# Altium schematic sheet thesis.SchDoc: Bachelor Thesis ESC (part 2 of 3)
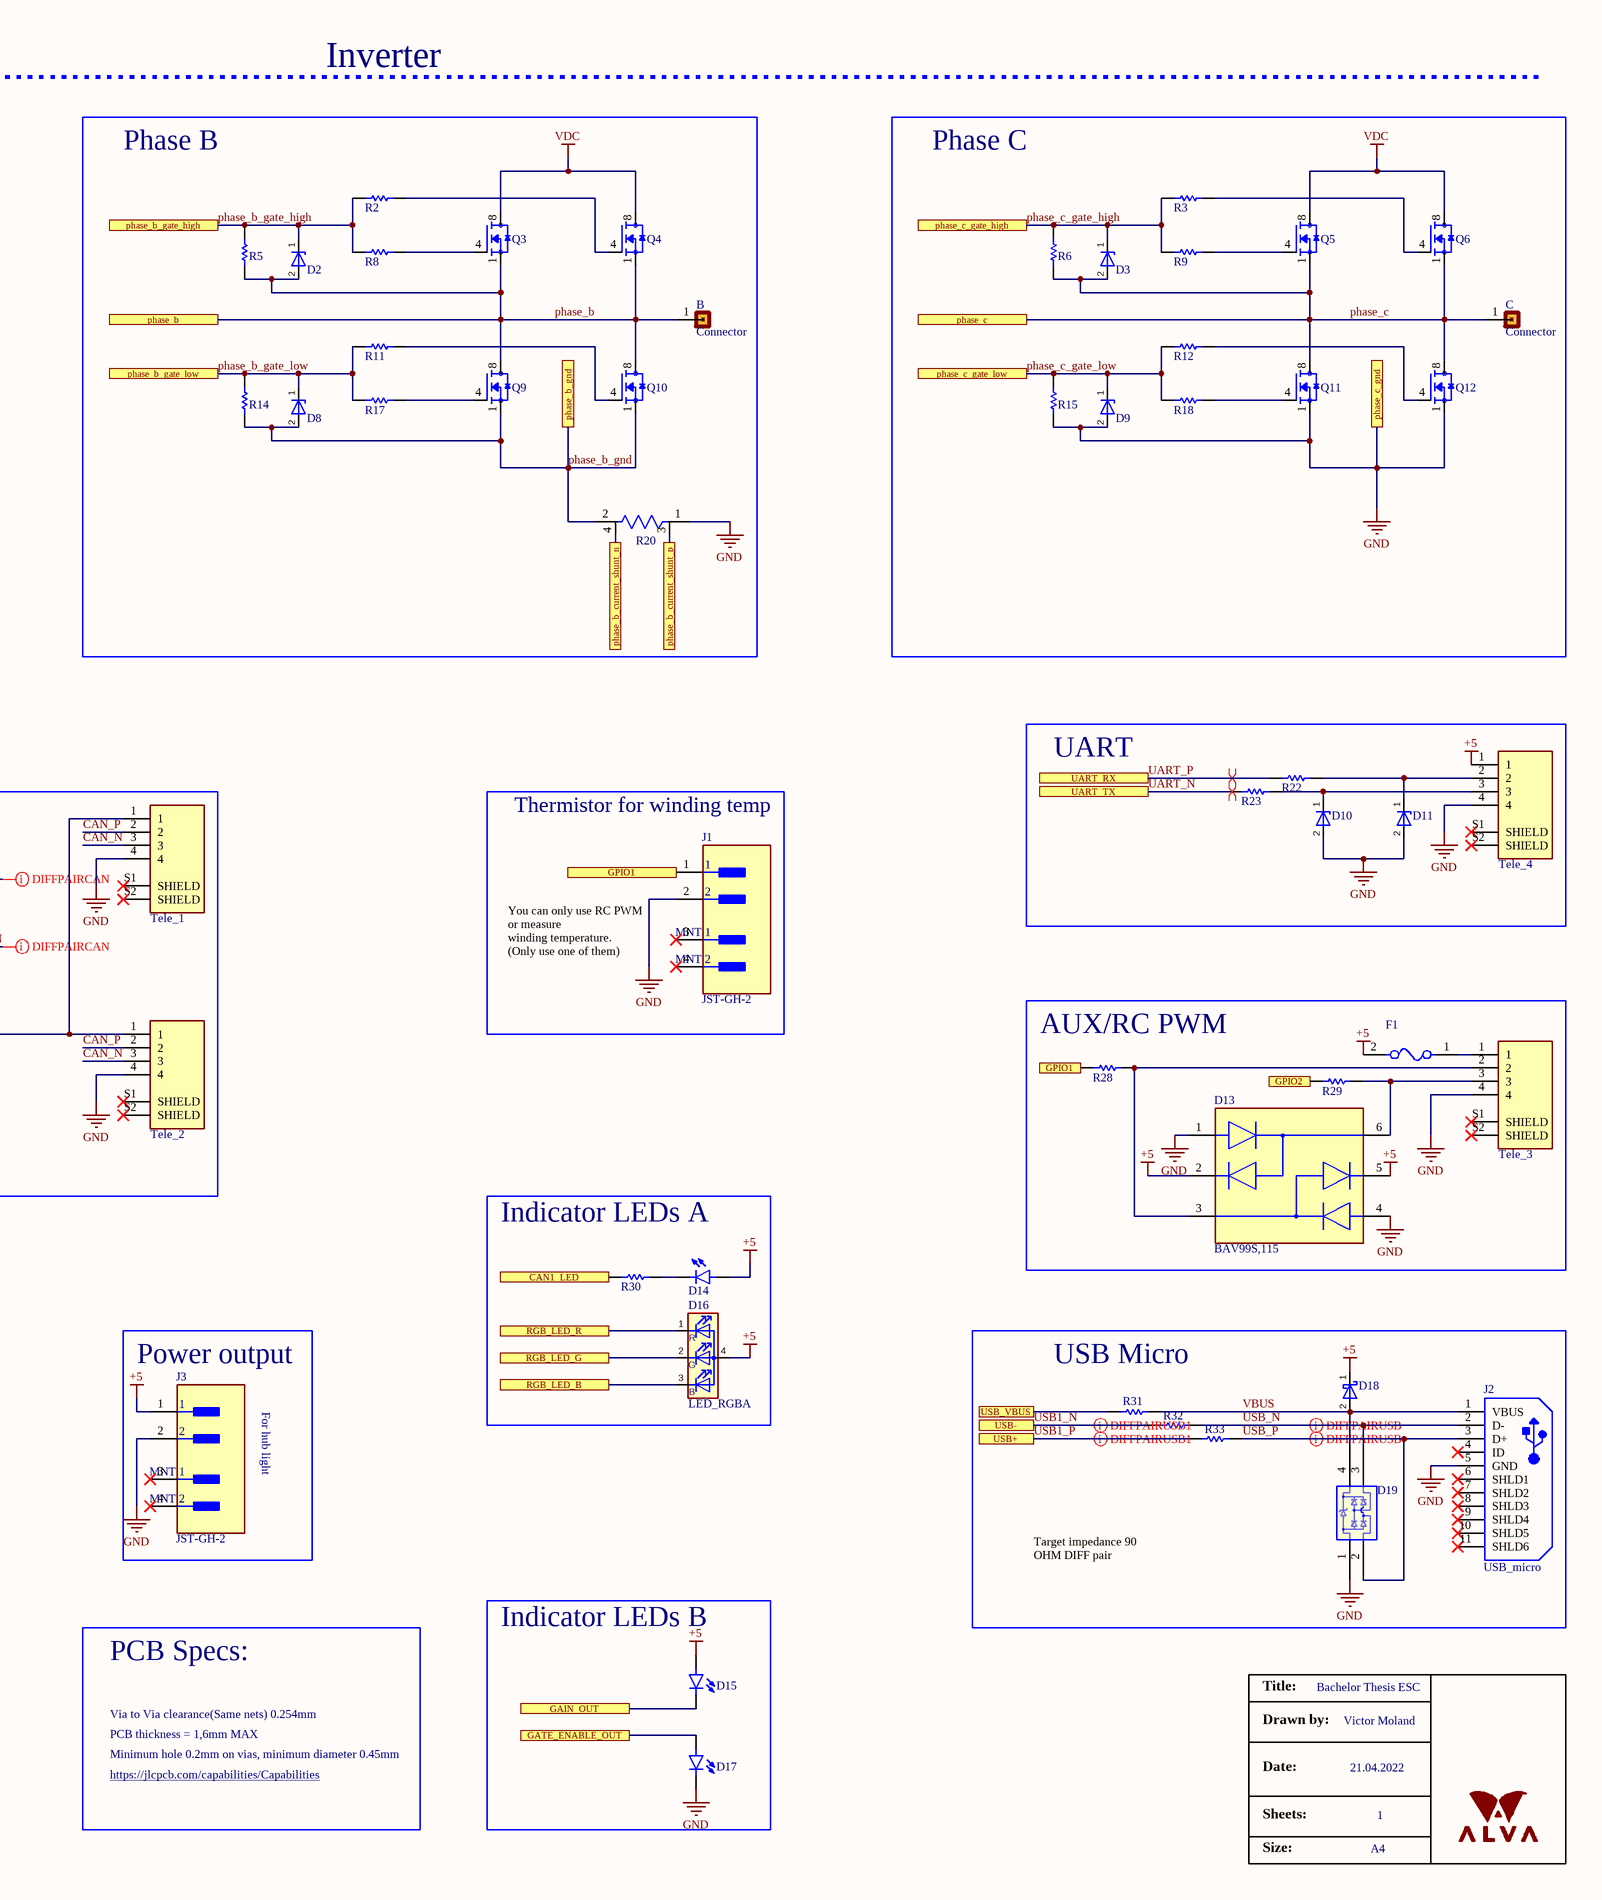
[diagram p2: thesis.SchDoc, right]
## Library data of the parts
* = LOGO: ALVA
A B C J_1 J_5 = Conn_01x01: Connector 01x01
C1 C2 = CAP_Radial: Aluminum Electrolytic Capacitor, Polarized, Aluminum (wet), 63V, 20% +Tol, 20% -Tol, 470uF, Through Hole Mount; Manufacturer: Panasonic; Manufacturer Part Number: ECA1JM471; Dielectric Material: Aluminium; Leakage Current: 296.1uA; Ripple Current: 750mA; Tan Delta: 0.11; Supplier 1: Digi-Key; Supplier Part Number 1: P5196-ND; RoHS: Yes; Category: Aluminum Electrolytic Capacitors; Pricing 1: 1=1,05000, 10=0,79500, 50=0,66020, 100=0,56850, 500=0,44010, 1000=0,37898, 2500=0,35452, 5000=0,33619 (USD); Mount: Through Hole; Number of Pins: 2; Package Shape: Cylindrical; Terminal Finish: Tin; Min Operating Temperature: -40°C; Max Operating Temperature: 85°C; JESD-609 Code: e3; Polarity: Polarized; Capacitance: 470uF; Capacitor Type: Aluminium; Negative Tolerance: 20%; Package Style: RadialMeter; Packaging: Bulk; Positive Tolerance: 20%; Rated DC Voltage (URdc): 63V; Termination: Wire; Diameter: 12.5mm; Length: 20mm; Terminal Pitch: 5mm; REACH SVHC: Yes; RoHS Compliant: Yes; ComponentLink1URL: https://datasheet.ciiva.com:443/pdfs/VipMasterIC/IC/PANA/PANA-S-A0009459698/PANA-S-A0009459698-1.pdf?src-supplier=IHS+Markit; ComponentLink1Description: https://datasheet.ciiva.com:443/pdfs/VipMasterIC/IC/PANA/PANA-S-A0009459698/PANA-S-A0009459698-1.pdf?src-supplier=IHS+Markit; ComponentLink2URL: https://datasheet.ciiva.com/11778/0900766b800274c2-11778050.pdf?src-supplier=RSComponents; ComponentLink2Description: https://datasheet.ciiva.com/11778/0900766b800274c2-11778050.pdf?src-supplier=RSComponents; ComponentLink3URL: https://datasheet.ciiva.com/48520/radial-m-eng-tds-48520521.pdf?src-supplier=Distrelec; ComponentLink3Description: https://datasheet.ciiva.com/48520/radial-m-eng-tds-48520521.pdf?src-supplier=Distrelec; ComponentLink4URL: https://datasheet.ciiva.com/14604/70067785-14604554.pdf?src-supplier=Allied+Electronics; ComponentLink4Description: https://datasheet.ciiva.com/14604/70067785-14604554.pdf?src-supplier=Allied+Electronics; ComponentLink5URL: https://datasheet.ciiva.com/43485/84340-43485354.pdf?src-supplier=Farnell; ComponentLink5Description: https://datasheet.ciiva.com/43485/84340-43485354.pdf?src-supplier=Farnell; ComponentLink6URL: https://datasheet.ciiva.com/46396/84340-46396590.pdf?src-supplier=Element14; ComponentLink6Description: https://datasheet.ciiva.com/46396/84340-46396590.pdf?src-supplier=Element14; ComponentLink7URL: https://datasheet.ciiva.com/11679/aba0000ce12-11679422.pdf?src-supplier=Avnet; ComponentLink7Description: https://datasheet.ciiva.com/11679/aba0000ce12-11679422.pdf?src-supplier=Avnet; ComponentLink8URL: https://datasheet.ciiva.com/16213/aba0000ce12-16213261.pdf?src-supplier=Future+Electronics; ComponentLink8Description: https://datasheet.ciiva.com/16213/aba0000ce12-16213261.pdf?src-supplier=Future+Electronics
C3-C12 = Cap_1210: Ceramic Capacitor, Multilayer, Ceramic, 100V, 10% +Tol, 10% -Tol, X7S, 22% TC, 4.7uF, Surface Mount, 1210; Manufacturer: Murata; Manufacturer Part Number: GCM32DC72A475KE02L; Multilayer: Yes; Reference Standard: AEC-Q200; Supplier 1: Digi-Key; Supplier Part Number 1: 490-14484-1-ND; RoHS: Yes; Category: Ceramic Capacitors; Stock 1: 12146; Pricing 1: 1=1,25000, 10=0,99000, 50=0,85800, 100=0,74250, 500=0,56100 (USD); Mount: Surface Mount; Number of Pins: 2; Dielectric Material: Ceramic; Package Shape: Rectangular; Size Code: 1210; Min Operating Temperature: -55°C; Max Operating Temperature: 125°C; Capacitance: 4.7uF; Capacitor Type: Ceramic; Negative Tolerance: 10%; Packaging: Tape and Reel; Positive Tolerance: 10%; Rated DC Voltage (URdc): 100V; Temperature Characteristics Code: X7S; Termination: Wraparound; REACH SVHC: Yes; RoHS Compliant: Yes; ComponentLink1URL: https://datasheet.ciiva.com:443/pdfs/VipMasterIC/IC/MURE/MURE-S-A0004442191/MURE-S-A0004444772-1.pdf?src-supplier=IHS+Markit; ComponentLink1Description: https://datasheet.ciiva.com:443/pdfs/VipMasterIC/IC/MURE/MURE-S-A0004442191/MURE-S-A0004444772-1.pdf?src-supplier=IHS+Markit; ComponentLink2URL: http://search.murata.co.jp/Ceramy/image/img/A01X/partnumbering_e_02.pdf?src-supplier=Digi-Key; ComponentLink2Description: http://search.murata.co.jp/Ceramy/image/img/A01X/partnumbering_e_02.pdf?src-supplier=Digi-Key
C13 C18 C20 = Cap_0603: Ceramic Capacitor, Multilayer, Ceramic, 25V, 10% +Tol, 10% -Tol, X5R, 15% TC, 0.1uF, Surface Mount, 0603; Manufacturer: Kyocera AVX; Manufacturer Part Number: 06033D104KAT2A; Capacitance: 100nF; Multilayer: Yes; Supplier 1: Digi-Key; RoHS: Yes; Category: Ceramic Capacitors; Stock 1: 1541; Pricing 1: 1=0,34000, 10=0,23100, 50=0,15400, 100=0,13090, 500=0,09240, 1000=0,08085 (USD); Mount: Surface Mount; Number of Pins: 2; Dielectric Material: Ceramic; Package Shape: Rectangular; Size Code: 0603; Terminal Finish: Nickel; Min Operating Temperature: -55°C; Max Operating Temperature: 85°C; JESD-609 Code: e3; Capacitor Type: Ceramic; Negative Tolerance: 10%; Package Style: SMTMeter; Packaging: Tape and Reel; Positive Tolerance: 10%; Rated DC Voltage (URdc): 25V; Temperature Characteristics Code: X5R; Termination: Wraparound; Length: 1.6mm; Width: 0.81mm; Height: 0.9mm; REACH SVHC: Yes; RoHS Compliant: Yes
  C13: Supplier Part Number 1: 478-1244-6-ND; ComponentLink1URL: https://datasheet.ciiva.com:443/pdfs/VipMasterIC/IC/AVXC/AVXC-S-A0009640604/AVXC-S-A0009640604-1.pdf?src-supplier=IHS+Markit; ComponentLink1Description: https://datasheet.ciiva.com:443/pdfs/VipMasterIC/IC/AVXC/AVXC-S-A0009640604/AVXC-S-A0009640604-1.pdf?src-supplier=IHS+Markit; ComponentLink2URL: https://datasheet.ciiva.com/19475/1031061-19475906.pdf?src-supplier=Jameco; ComponentLink2Description: https://datasheet.ciiva.com/19475/1031061-19475906.pdf?src-supplier=Jameco; ComponentLink3URL: https://datasheet.ciiva.com/152/cx5r-152225.pdf?src-supplier=Digi-Key; ComponentLink3Description: https://datasheet.ciiva.com/152/cx5r-152225.pdf?src-supplier=Digi-Key; ComponentLink4URL: https://datasheet.ciiva.com/2987/cx5r-2987761.pdf?src-supplier=Avnet; ComponentLink4Description: https://datasheet.ciiva.com/2987/cx5r-2987761.pdf?src-supplier=Avnet; ComponentLink5URL: https://datasheet.ciiva.com/152/cx5r-152226.pdf?src-supplier=Digi-Key; ComponentLink5Description: https://datasheet.ciiva.com/152/cx5r-152226.pdf?src-supplier=Digi-Key; ComponentLink6URL: https://datasheet.ciiva.com/2987/cx5r-2987762.pdf?src-supplier=Avnet; ComponentLink6Description: https://datasheet.ciiva.com/2987/cx5r-2987762.pdf?src-supplier=Avnet; ComponentLink7URL: https://datasheet.ciiva.com/152/cx5r-152227.pdf?src-supplier=Digi-Key; ComponentLink7Description: https://datasheet.ciiva.com/152/cx5r-152227.pdf?src-supplier=Digi-Key; ComponentLink8URL: https://datasheet.ciiva.com/28613/1666675-28613275.pdf?src-supplier=Element14; ComponentLink8Description: https://datasheet.ciiva.com/28613/1666675-28613275.pdf?src-supplier=Element14; ComponentLink9URL: https://datasheet.ciiva.com/28613/1666675-28613037.pdf?src-supplier=Element14; ComponentLink9Description: https://datasheet.ciiva.com/28613/1666675-28613037.pdf?src-supplier=Element14; ComponentLink10URL: https://datasheet.ciiva.com/16397/cx5r-16397162.pdf?src-supplier=Future+Electronics; ComponentLink10Description: https://datasheet.ciiva.com/16397/cx5r-16397162.pdf?src-supplier=Future+Electronics; ComponentLink11URL: https://datasheet.ciiva.com/28613/759405-28613274.pdf?src-supplier=Element14; ComponentLink11Description: https://datasheet.ciiva.com/28613/759405-28613274.pdf?src-supplier=Element14
  C18: Supplier Part Number 1: 478-1244-1-ND; ComponentLink1URL: https://datasheet.ciiva.com:443/pdfs/VipMasterIC/IC/AVXC/AVXC-S-A0009640604/AVXC-S-A0009640604-1.pdf?src-supplier=IHS+Markit; ComponentLink1Description: https://datasheet.ciiva.com:443/pdfs/VipMasterIC/IC/AVXC/AVXC-S-A0009640604/AVXC-S-A0009640604-1.pdf?src-supplier=IHS+Markit; ComponentLink2URL: https://datasheet.ciiva.com/19475/1031061-19475906.pdf?src-supplier=Jameco; ComponentLink2Description: https://datasheet.ciiva.com/19475/1031061-19475906.pdf?src-supplier=Jameco; ComponentLink3URL: https://datasheet.ciiva.com/152/cx5r-152225.pdf?src-supplier=Digi-Key; ComponentLink3Description: https://datasheet.ciiva.com/152/cx5r-152225.pdf?src-supplier=Digi-Key; ComponentLink4URL: https://datasheet.ciiva.com/2987/cx5r-2987761.pdf?src-supplier=Avnet; ComponentLink4Description: https://datasheet.ciiva.com/2987/cx5r-2987761.pdf?src-supplier=Avnet; ComponentLink5URL: https://datasheet.ciiva.com/152/cx5r-152226.pdf?src-supplier=Digi-Key; ComponentLink5Description: https://datasheet.ciiva.com/152/cx5r-152226.pdf?src-supplier=Digi-Key; ComponentLink6URL: https://datasheet.ciiva.com/2987/cx5r-2987762.pdf?src-supplier=Avnet; ComponentLink6Description: https://datasheet.ciiva.com/2987/cx5r-2987762.pdf?src-supplier=Avnet; ComponentLink7URL: https://datasheet.ciiva.com/152/cx5r-152227.pdf?src-supplier=Digi-Key; ComponentLink7Description: https://datasheet.ciiva.com/152/cx5r-152227.pdf?src-supplier=Digi-Key; ComponentLink8URL: https://datasheet.ciiva.com/28613/1666675-28613275.pdf?src-supplier=Element14; ComponentLink8Description: https://datasheet.ciiva.com/28613/1666675-28613275.pdf?src-supplier=Element14; ComponentLink9URL: https://datasheet.ciiva.com/28613/1666675-28613037.pdf?src-supplier=Element14; ComponentLink9Description: https://datasheet.ciiva.com/28613/1666675-28613037.pdf?src-supplier=Element14; ComponentLink10URL: https://datasheet.ciiva.com/16397/cx5r-16397162.pdf?src-supplier=Future+Electronics; ComponentLink10Description: https://datasheet.ciiva.com/16397/cx5r-16397162.pdf?src-supplier=Future+Electronics; ComponentLink11URL: https://datasheet.ciiva.com/28613/759405-28613274.pdf?src-supplier=Element14; ComponentLink11Description: https://datasheet.ciiva.com/28613/759405-28613274.pdf?src-supplier=Element14
  C20: ComponentLink1URL: https://datasheet.ciiva.com:443/pdfs/VipMasterIC/IC/MURE/MURE-S-A0004370842/MURE-S-A0004372063-1.pdf?src-supplier=IHS+Markit; ComponentLink1Description: https://datasheet.ciiva.com:443/pdfs/VipMasterIC/IC/MURE/MURE-S-A0004370842/MURE-S-A0004372063-1.pdf?src-supplier=IHS+Markit; ComponentLink2URL: http://search.murata.co.jp/Ceramy/image/img/A01X/G101/ENG/GCM155R71E104KE02-01.pdf?src-supplier=Digi-Key; ComponentLink2Description: http://search.murata.co.jp/Ceramy/image/img/A01X/G101/ENG/GCM155R71E104KE02-01.pdf?src-supplier=Digi-Key; Supplier Part Number 1: 478-1244-6-ND; ComponentLink3URL: https://datasheet.ciiva.com:443/pdfs/VipMasterIC/IC/AVXC/AVXC-S-A0009640604/AVXC-S-A0009640604-1.pdf?src-supplier=IHS+Markit; ComponentLink3Description: https://datasheet.ciiva.com:443/pdfs/VipMasterIC/IC/AVXC/AVXC-S-A0009640604/AVXC-S-A0009640604-1.pdf?src-supplier=IHS+Markit; ComponentLink4URL: https://datasheet.ciiva.com/19475/1031061-19475906.pdf?src-supplier=Jameco; ComponentLink4Description: https://datasheet.ciiva.com/19475/1031061-19475906.pdf?src-supplier=Jameco; ComponentLink5URL: https://datasheet.ciiva.com/152/cx5r-152225.pdf?src-supplier=Digi-Key; ComponentLink5Description: https://datasheet.ciiva.com/152/cx5r-152225.pdf?src-supplier=Digi-Key; ComponentLink6URL: https://datasheet.ciiva.com/2987/cx5r-2987761.pdf?src-supplier=Avnet; ComponentLink6Description: https://datasheet.ciiva.com/2987/cx5r-2987761.pdf?src-supplier=Avnet; ComponentLink7URL: https://datasheet.ciiva.com/152/cx5r-152226.pdf?src-supplier=Digi-Key; ComponentLink7Description: https://datasheet.ciiva.com/152/cx5r-152226.pdf?src-supplier=Digi-Key; ComponentLink8URL: https://datasheet.ciiva.com/2987/cx5r-2987762.pdf?src-supplier=Avnet; ComponentLink8Description: https://datasheet.ciiva.com/2987/cx5r-2987762.pdf?src-supplier=Avnet; ComponentLink9URL: https://datasheet.ciiva.com/152/cx5r-152227.pdf?src-supplier=Digi-Key; ComponentLink9Description: https://datasheet.ciiva.com/152/cx5r-152227.pdf?src-supplier=Digi-Key; ComponentLink10URL: https://datasheet.ciiva.com/28613/1666675-28613275.pdf?src-supplier=Element14; ComponentLink10Description: https://datasheet.ciiva.com/28613/1666675-28613275.pdf?src-supplier=Element14; ComponentLink11URL: https://datasheet.ciiva.com/28613/1666675-28613037.pdf?src-supplier=Element14; ComponentLink11Description: https://datasheet.ciiva.com/28613/1666675-28613037.pdf?src-supplier=Element14; ComponentLink12URL: https://datasheet.ciiva.com/16397/cx5r-16397162.pdf?src-supplier=Future+Electronics; ComponentLink12Description: https://datasheet.ciiva.com/16397/cx5r-16397162.pdf?src-supplier=Future+Electronics; ComponentLink13URL: https://datasheet.ciiva.com/28613/759405-28613274.pdf?src-supplier=Element14; ComponentLink13Description: https://datasheet.ciiva.com/28613/759405-28613274.pdf?src-supplier=Element14
C14 = Cap_0603: Ceramic Capacitor, Multilayer, Ceramic, 16V, 10% +Tol, 10% -Tol, X5R, 15% TC, 1uF, Surface Mount, 0603; Manufacturer: Kyocera AVX; Manufacturer Part Number: 0603YD105KAT2A; Multilayer: Yes; Supplier 1: Digi-Key; Supplier Part Number 1: 478-1249-1-ND; RoHS: Yes; Category: Ceramic Capacitors; Stock 1: 1775727; Pricing 1: 1=0,13000, 10=0,09000, 50=0,05080, 100=0,04210, 500=0,02952, 1000=0,02444 (USD); Mount: Surface Mount; Number of Pins: 2; Dielectric Material: Ceramic; Package Shape: Rectangular; Size Code: 0603; Terminal Finish: Nickel; Min Operating Temperature: -55°C; Max Operating Temperature: 85°C; Capacitance: 1uF; Capacitor Type: Ceramic; Negative Tolerance: 10%; Package Style: SMTMeter; Packaging: Tape and Reel; Positive Tolerance: 10%; Rated DC Voltage (URdc): 16V; Temperature Characteristics Code: X5R; Termination: Wraparound; JESD-609 Code: e3; Length: 1.6mm; Width: 0.81mm; Height: 0.9mm; REACH SVHC: Yes; RoHS Compliant: Yes; ComponentLink1URL: https://datasheet.ciiva.com:443/pdfs/VipMasterIC/IC/AVXC/AVXC-S-A0009640604/AVXC-S-A0009640604-1.pdf?src-supplier=IHS+Markit; ComponentLink1Description: https://datasheet.ciiva.com:443/pdfs/VipMasterIC/IC/AVXC/AVXC-S-A0009640604/AVXC-S-A0009640604-1.pdf?src-supplier=IHS+Markit; ComponentLink2URL: https://datasheet.ciiva.com/11788/0900766b80def1a5-11788563.pdf?src-supplier=RSComponents; ComponentLink2Description: https://datasheet.ciiva.com/11788/0900766b80def1a5-11788563.pdf?src-supplier=RSComponents; ComponentLink3URL: https://datasheet.ciiva.com/34303/2012654-34303835.pdf?src-supplier=Jameco; ComponentLink3Description: https://datasheet.ciiva.com/34303/2012654-34303835.pdf?src-supplier=Jameco; ComponentLink4URL: https://datasheet.ciiva.com/2987/cx5r-2987890.pdf?src-supplier=Avnet; ComponentLink4Description: https://datasheet.ciiva.com/2987/cx5r-2987890.pdf?src-supplier=Avnet; ComponentLink5URL: https://datasheet.ciiva.com/5412/cx5r-5412550.pdf?src-supplier=Mouser; ComponentLink5Description: https://datasheet.ciiva.com/5412/cx5r-5412550.pdf?src-supplier=Mouser; ComponentLink6URL: https://datasheet.ciiva.com/150/cx5r-150392.pdf?src-supplier=Digi-Key; ComponentLink6Description: https://datasheet.ciiva.com/150/cx5r-150392.pdf?src-supplier=Digi-Key; ComponentLink7URL: https://datasheet.ciiva.com/14590/70001028-14590632.pdf?src-supplier=Allied+Electronics; ComponentLink7Description: https://datasheet.ciiva.com/14590/70001028-14590632.pdf?src-supplier=Allied+Electronics; ComponentLink8URL: https://datasheet.ciiva.com/14586/70001028-14586715.pdf?src-supplier=Allied+Electronics; ComponentLink8Description: https://datasheet.ciiva.com/14586/70001028-14586715.pdf?src-supplier=Allied+Electronics; ComponentLink9URL: https://datasheet.ciiva.com/150/cx5r-150393.pdf?src-supplier=Digi-Key; ComponentLink9Description: https://datasheet.ciiva.com/150/cx5r-150393.pdf?src-supplier=Digi-Key; ComponentLink10URL: https://datasheet.ciiva.com/1458/84508-1458137.pdf?src-supplier=Element14; ComponentLink10Description: https://datasheet.ciiva.com/1458/84508-1458137.pdf?src-supplier=Element14; ComponentLink11URL: https://datasheet.ciiva.com/150/cx5r-150394.pdf?src-supplier=Digi-Key; ComponentLink11Description: https://datasheet.ciiva.com/150/cx5r-150394.pdf?src-supplier=Digi-Key; ComponentLink12URL: https://datasheet.ciiva.com/1458/84508-1458138.pdf?src-supplier=Element14; ComponentLink12Description: https://datasheet.ciiva.com/1458/84508-1458138.pdf?src-supplier=Element14
C15-C17 = Cap_0603: Ceramic Capacitor, Multilayer, Ceramic, 16V, 10% +Tol, 10% -Tol, X6S, 22% TC, 4.7uF, Surface Mount, 0603; Manufacturer: Murata; Manufacturer Part Number: GRT188C81C475KE13D; Multilayer: Yes; Reference Standard: AEC-Q200; Supplier 1: Digi-Key; Supplier Part Number 1: 490-12289-1-ND; RoHS: Yes; Category: Ceramic Capacitors; Stock 1: 305710; Pricing 1: 1=0,31000, 10=0,21000, 50=0,14000, 100=0,11890, 500=0,08396, 1000=0,07346 (USD); Mount: Surface Mount; Number of Pins: 2; Dielectric Material: Ceramic; Package Shape: Rectangular; Size Code: 0603; Terminal Finish: Nickel; Min Operating Temperature: -55°C; Max Operating Temperature: 105°C; JESD-609 Code: e3; Capacitance: 4.7uF; Capacitor Type: Ceramic; Negative Tolerance: 10%; Packaging: Tape and Reel; Positive Tolerance: 10%; Rated DC Voltage (URdc): 16V; Temperature Characteristics Code: X6S; Termination: Wraparound; REACH SVHC: Yes; RoHS Compliant: Yes; ComponentLink1URL: https://datasheet.ciiva.com:443/pdfs/VipMasterIC/IC/MURE/MURE-S-A0004410517/MURE-S-A0004413550-1.pdf?src-supplier=IHS+Markit; ComponentLink1Description: https://datasheet.ciiva.com:443/pdfs/VipMasterIC/IC/MURE/MURE-S-A0004410517/MURE-S-A0004413550-1.pdf?src-supplier=IHS+Markit; ComponentLink2URL: http://search.murata.co.jp/Ceramy/image/img/A01X/G101/ENG/GRT188C81C475KE13-01.pdf?src-supplier=Digi-Key; ComponentLink2Description: http://search.murata.co.jp/Ceramy/image/img/A01X/G101/ENG/GRT188C81C475KE13-01.pdf?src-supplier=Digi-Key
C19 = Cap_0603: Ceramic Capacitor, Multilayer, Ceramic, 50V, 10% +Tol, 10% -Tol, X7R, 15% TC, 0.00068uF, Surface Mount, 0603; Manufacturer: Kyocera AVX; Manufacturer Part Number: 06035C681KAT2A; Capacitance: 680pF; Multilayer: Yes; Supplier 1: Newark; Supplier Part Number 1: 95W9221; RoHS: Yes; Category: Ceramic Capacitors; Stock 1: 68350; Pricing 1: 10=0,14300, 25=0,12000, 50=0,09600, 100=0,07300, 250=0,06200, 500=0,05000, 1000=0,04500 (USD); Mount: Surface Mount; Number of Pins: 2; Dielectric Material: Ceramic; Size Code: 0603; Terminal Finish: Nickel; Package Shape: Rectangular; Min Operating Temperature: -55°C; Max Operating Temperature: 125°C; JESD-609 Code: e3; Capacitor Type: Ceramic; Negative Tolerance: 10%; Package Style: SMTMeter; Packaging: Tape and Reel; Positive Tolerance: 10%; Rated DC Voltage (URdc): 50V; Temperature Characteristics Code: X7R; Termination: Wraparound; Length: 1.6mm; Width: 0.81mm; Height: 0.9mm; REACH SVHC: Yes; RoHS Compliant: Yes; ComponentLink1URL: https://datasheet.ciiva.com:443/pdfs/VipMasterIC/IC/AVXC/AVXC-S-A0009640452/AVXC-S-A0009640452-1.pdf?src-supplier=IHS+Markit; ComponentLink1Description: https://datasheet.ciiva.com:443/pdfs/VipMasterIC/IC/AVXC/AVXC-S-A0009640452/AVXC-S-A0009640452-1.pdf?src-supplier=IHS+Markit; ComponentLink2URL: https://datasheet.ciiva.com/15212/getdatasheetpartid-131075-15212330.pdf?src-supplier=Verical; ComponentLink2Description: https://datasheet.ciiva.com/15212/getdatasheetpartid-131075-15212330.pdf?src-supplier=Verical; ComponentLink3URL: https://datasheet.ciiva.com/151/cx7r-151060.pdf?src-supplier=Digi-Key; ComponentLink3Description: https://datasheet.ciiva.com/151/cx7r-151060.pdf?src-supplier=Digi-Key; ComponentLink4URL: https://datasheet.ciiva.com/151/cx7r-151061.pdf?src-supplier=Digi-Key; ComponentLink4Description: https://datasheet.ciiva.com/151/cx7r-151061.pdf?src-supplier=Digi-Key; ComponentLink5URL: https://datasheet.ciiva.com/151/cx7r-151062.pdf?src-supplier=Digi-Key; ComponentLink5Description: https://datasheet.ciiva.com/151/cx7r-151062.pdf?src-supplier=Digi-Key; ComponentLink6URL: https://datasheet.ciiva.com/11522/cx7r-11522102.pdf?src-supplier=Avnet; ComponentLink6Description: https://datasheet.ciiva.com/11522/cx7r-11522102.pdf?src-supplier=Avnet; ComponentLink7URL: https://datasheet.ciiva.com/22676/1679506-22676967.pdf?src-supplier=Element14; ComponentLink7Description: https://datasheet.ciiva.com/22676/1679506-22676967.pdf?src-supplier=Element14; ComponentLink8URL: https://datasheet.ciiva.com/28533/1679506-28533415.pdf?src-supplier=Element14; ComponentLink8Description: https://datasheet.ciiva.com/28533/1679506-28533415.pdf?src-supplier=Element14; ComponentLink9URL: https://datasheet.ciiva.com/5415/cx7r-5415849.pdf?src-supplier=Mouser; ComponentLink9Description: https://datasheet.ciiva.com/5415/cx7r-5415849.pdf?src-supplier=Mouser; ComponentLink10URL: https://datasheet.ciiva.com/11499/cx7r-11499705.pdf?src-supplier=Avnet; ComponentLink10Description: https://datasheet.ciiva.com/11499/cx7r-11499705.pdf?src-supplier=Avnet
C21 = Cap_1210: Ceramic Capacitor, Multilayer, Ceramic, 10V, 20% +Tol, 20% -Tol, X7R, 15% TC, 47uF, Surface Mount, 1210; Manufacturer: Murata; Manufacturer Part Number: GRM32ER71A476ME15L; Multilayer: Yes; Supplier 1: Digi-Key; Supplier Part Number 1: 490-6543-1-ND; RoHS: Yes; Category: Ceramic Capacitors; Stock 1: 52676; Pricing 1: 1=0,96000, 10=0,72900, 50=0,60600, 100=0,52180, 500=0,40394 (USD); Mount: Surface Mount; Number of Pins: 2; Dielectric Material: Ceramic; Package Shape: Rectangular; Size Code: 1210; Terminal Finish: Nickel; Min Operating Temperature: -55°C; Max Operating Temperature: 125°C; JESD-609 Code: e3; Capacitance: 47uF; Capacitor Type: Ceramic; Negative Tolerance: 20%; Package Style: SMTMeter; Packaging: Tape and Reel; Positive Tolerance: 20%; Rated DC Voltage (URdc): 10V; Temperature Characteristics Code: X7R; Termination: Wraparound; Length: 3.2mm; Width: 2.5mm; Height: 2.5mm; REACH SVHC: Yes; RoHS Compliant: Yes; ComponentLink1URL: https://datasheet.ciiva.com:443/pdfs/VipMasterIC/IC/MURE/MURE-S-A0000034126/MURE-S-A0000034126-1.pdf?src-supplier=IHS+Markit; ComponentLink1Description: https://datasheet.ciiva.com:443/pdfs/VipMasterIC/IC/MURE/MURE-S-A0000034126/MURE-S-A0000034126-1.pdf?src-supplier=IHS+Markit; ComponentLink2URL: https://datasheet.ciiva.com/46441/1754712-46441338.pdf?src-supplier=Element14; ComponentLink2Description: https://datasheet.ciiva.com/46441/1754712-46441338.pdf?src-supplier=Element14; ComponentLink3URL: https://datasheet.ciiva.com/6264/partnumbering-e-01-6264587.pdf?src-supplier=Digi-Key; ComponentLink3Description: https://datasheet.ciiva.com/6264/partnumbering-e-01-6264587.pdf?src-supplier=Digi-Key; ComponentLink4URL: https://datasheet.ciiva.com/6264/partnumbering-e-01-6264586.pdf?src-supplier=Digi-Key; ComponentLink4Description: https://datasheet.ciiva.com/6264/partnumbering-e-01-6264586.pdf?src-supplier=Digi-Key; ComponentLink5URL: https://datasheet.ciiva.com/6264/partnumbering-e-01-6264588.pdf?src-supplier=Digi-Key; ComponentLink5Description: https://datasheet.ciiva.com/6264/partnumbering-e-01-6264588.pdf?src-supplier=Digi-Key; ComponentLink6URL: https://datasheet.ciiva.com/11606/product-11606523.pdf?src-supplier=Avnet; ComponentLink6Description: https://datasheet.ciiva.com/11606/product-11606523.pdf?src-supplier=Avnet; ComponentLink7URL: https://datasheet.ciiva.com/16497/product-16497006.pdf?src-supplier=Future+Electronics; ComponentLink7Description: https://datasheet.ciiva.com/16497/product-16497006.pdf?src-supplier=Future+Electronics
D1-D3 D7-D9 = Zener_16V: Manufacturer: Taiwan Semiconductor; Supplier 1: Digi-Key; Manufacturer Part Number: BZD27C16PWH; RoHS: No; Category: Zener Diodes; Stock 1: 1746; Pricing 1: 1=0,52000, 10=0,44700, 100=0,33350, 500=0,26202, 1000=0,20247 (USD); Supplier Part Number 1: BZD27C16PWHCT-ND
D4-D6 = Zener_51V: Trans Voltage Suppressor Diode, 5000W, 51V V(RWM), Unidirectional, 1 Element, Silicon, DO-214AB; Manufacturer: Vishay; Package Body Material: Plastic; Additional Feature: EXCELLENT CLAMPING CAPABILITY; Max Breakdown Voltage: 62.7V; Min Breakdown Voltage: 56.7V; Non-rep Peak Rev Power Dis-Max: 5kW; Number of Elements: 1; Time @ Peak Reflow Temperature-Max (s): 30s; Reference Standard: IEC-61000-4-2; Supplier 1: Digi-Key; Supplier Part Number 1: SMC5K51A-M3/IGICT-ND; Manufacturer Part Number: SMC5K51A-M3/I; RoHS: Yes; Category: TVS Diodes; Stock 1: 764; Pricing 1: 1=0,94000, 10=0,84400, 100=0,65780, 500=0,54340, 1000=0,42900 (USD); Number of Pins: 2; Diode Element Material: SILICON; Package Shape: Rectangular; Terminal Finish: Tin; Min Operating Temperature: -55°C; Max Operating Temperature: 150°C; JESD-609 Code: e3; Polarity: Unidirectional; Diode Type: TRANS VOLTAGE SUPPRESSOR; JESD-30 Code: R-PDSO-C2; Moisture Sensitivity Level: 1; Package Style: SMALL OUTLINEMeter; Peak Reflow Temperature (Cel): 260°C; Rep Pk Reverse Voltage-Max: 51V; Surface Mount: Yes; Technology: AVALANCHE; Terminal Form: C BEND; Terminal Position: DUAL; JEDEC-95 Code: DO-214AB; REACH SVHC: No SVHC; RoHS Compliant: Yes; ComponentLink1URL: https://datasheet.ciiva.com:443/pdfs/VipMasterIC/IC/VISH/VISH-S-A0007266867/VISH-S-A0007266867-1.pdf?src-supplier=IHS+Markit; ComponentLink1Description: https://datasheet.ciiva.com:443/pdfs/VipMasterIC/IC/VISH/VISH-S-A0007266867/VISH-S-A0007266867-1.pdf?src-supplier=IHS+Markit; ComponentLink2URL: http://www.vishay.com/docs/87742/smc5k10a.pdf?src-supplier=Digi-Key; ComponentLink2Description: http://www.vishay.com/docs/87742/smc5k10a.pdf?src-supplier=Digi-Key
D10 D11 = Zener_5V: Trans Voltage Suppressor Diode, 200W, 5V V(RWM), Unidirectional, 1 Element, Silicon; Manufacturer: MCC; Package Body Material: Plastic; Max Breakdown Voltage: 7V; Min Breakdown Voltage: 6.4V; Breakdown Voltage-Nom: 6.7V; Clamping Voltage-Max: 9.2V; Number of Elements: 1; Time @ Peak Reflow Temperature-Max (s): 10s; Qualification Status: Not Qualified; Supplier 1: Digi-Key; Manufacturer Part Number: SMF5.0A-TP; RoHS: Yes; Category: TVS Diodes; Stock 1: 83846; Pricing 1: 1=0,45000, 10=0,33600, 100=0,20900, 500=0,14300, 1000=0,11000 (USD); Number of Pins: 2; Diode Element Material: SILICON; Package Shape: Rectangular; Terminal Finish: Tin; JESD-609 Code: e3; Polarity: Unidirectional; Diode Type: TRANS VOLTAGE SUPPRESSOR; JESD-30 Code: R-PDSO-F2; Moisture Sensitivity Level: 1; Non-rep Peak Rev Power Dis-Max: 200W; Package Style: SMALL OUTLINEMeter; Peak Reflow Temperature (Cel): 260°C; Rep Pk Reverse Voltage-Max: 5V; Surface Mount: Yes; Technology: AVALANCHE; Terminal Form: Flat; Terminal Position: DUAL; REACH SVHC: No SVHC; RoHS Compliant: Yes; ComponentLink1URL: https://datasheet.ciiva.com:443/pdfs/VipMasterIC/IC/MCCC/MCCC-S-A0009835486/MCCC-S-A0009835486-1.pdf?src-supplier=IHS+Markit; ComponentLink1Description: https://datasheet.ciiva.com:443/pdfs/VipMasterIC/IC/MCCC/MCCC-S-A0009835486/MCCC-S-A0009835486-1.pdf?src-supplier=IHS+Markit; ComponentLink2URL: https://datasheet.ciiva.com/333/smf5-0170sod-123fl-333395.pdf?src-supplier=Digi-Key; ComponentLink2Description: https://datasheet.ciiva.com/333/smf5-0170sod-123fl-333395.pdf?src-supplier=Digi-Key; ComponentLink3URL: https://datasheet.ciiva.com/333/smf5-0170sod-123fl-333396.pdf?src-supplier=Digi-Key; ComponentLink3Description: https://datasheet.ciiva.com/333/smf5-0170sod-123fl-333396.pdf?src-supplier=Digi-Key; ComponentLink4URL: https://datasheet.ciiva.com/333/smf5-0170sod-123fl-333394.pdf?src-supplier=Digi-Key; ComponentLink4Description: https://datasheet.ciiva.com/333/smf5-0170sod-123fl-333394.pdf?src-supplier=Digi-Key; Supplier Part Number 1: SMF5.0A-TPMSCT-ND
D12 D15 = LED0603(LTW-C193TS5): Top View / 0402 / 1.0X0.5X0.4; Manufacturer: Inolux; Manufacturer Part Number: IN-S42BTR; Supplier 1: Digi-Key; Supplier Part Number 1: 1830-IN-S42BCT-ND; RoHS: No; Stock 1: 7626; Pricing 1: 1=0,28000, 10=0,21900, 100=0,09860, 500=0,08904, 1000=0,07314 (USD)
D13 = BAV99S: Rectifier Diode, 4 Element, 0.2A, 85V V(RRM), Silicon; Manufacturer: Infineon; Package Body Material: Plastic; Number of Elements: 4; Max Output Current: 200mA; Max Power Dissipation: 250mW; Reverse Recovery Time-Max: 0.004us; Forward Voltage-Max (VF): 1.25V; Max Reverse Current: 2.5uA; Reverse Test Voltage: 70V; Qualification Status: Not Qualified; RoHS Compliant: Yes; Supplier 1: Digi-Key; Manufacturer Part Number: BAV99S; RoHS: Yes; Category: Rectifier Diodes; Pricing 1: 1=0,50000, 10=0,37900, 100=0,23600, 500=0,16146, 1000=0,12420 (USD); Number of Pins: 6; Diode Element Material: SILICON; Package Shape: Rectangular; Terminal Finish: Tin; Min Operating Temperature: -65°C; Max Operating Temperature: 150°C; JESD-609 Code: e3; Diode Type: RECTIFIER; JESD-30 Code: R-PDSO-G6; Package Style: SMALL OUTLINEMeter; Rep Pk Reverse Voltage-Max: 85V; Surface Mount: Yes; Terminal Form: Gull Wing; Terminal Position: DUAL; Moisture Sensitivity Level: 1; Peak Reflow Temperature (Cel): 260°C; REACH SVHC: Yes; ComponentLink1URL: https://datasheet.ciiva.com:443/pdfs/VipMasterIC/IC/INFN/INFNS11225/INFNS11225-1.pdf?src-supplier=IHS+Markit; ComponentLink1Description: https://datasheet.ciiva.com:443/pdfs/VipMasterIC/IC/INFN/INFNS11225/INFNS11225-1.pdf?src-supplier=IHS+Markit; ComponentLink2URL: https://datasheet.ciiva.com/5833/45911-5833673.pdf?src-supplier=Farnell; ComponentLink2Description: https://datasheet.ciiva.com/5833/45911-5833673.pdf?src-supplier=Farnell; ComponentLink3URL: https://datasheet.ciiva.com/1180/45911-1180780.pdf?src-supplier=Element14; ComponentLink3Description: https://datasheet.ciiva.com/1180/45911-1180780.pdf?src-supplier=Element14; Supplier Part Number 1: BAV99SH6327XTSA1DKR-ND
D14 D17 = LED0603(LTW-C193TS5): White LED Indication - Discrete 2.93V 0603 (1608 Metric); Manufacturer: Inolux; Manufacturer Part Number: IN-S42BT5G; Supplier 1: Digi-Key; Supplier Part Number 1: 1830-IN-S42BT5GCT-ND; RoHS: No; Stock 1: 52898; Pricing 1: 1=0,38000, 10=0,24800, 100=0,16550, 500=0,11448, 1000=0,09540 (USD)
D16 = LED_RGBA: LED RGB 0606 SMD; Manufacturer: Dialight; Manufacturer Part Number: 5977715607F; Supplier 1: Digi-Key; RoHS: No; Stock 1: 6970; Pricing 1: 1=0,70000, 10=0,46200, 100=0,30540, 1000=0,23579, 2000=0,21306 (USD); ComponentLink1URL: http://www.dialightsignalsandcomponents.com/Assets/Drawings/2D_Drawings_DrawingDetailedSpec/NewDrawings/597%20Series_0418/597%20Series%20SMD%200606Tri%205mA%20Zener%20Detailed%20Spec%20.pdf?src-supplier=Digi-Key; ComponentLink1Description: http://www.dialightsignalsandcomponents.com/Assets/Drawings/2D_Drawings_DrawingDetailedSpec/NewDrawings/597%20Series_0418/597%20Series%20SMD%200606Tri%205mA%20Zener%20Detailed%20Spec%20.pdf?src-supplier=Digi-Key; Supplier Part Number 1: 350-4396-1-ND
D18 = PMEG2010AEH: Rectifier Diode, Schottky, 1 Phase, 1 Element, 1A, Silicon; Manufacturer: Nexperia; Manufacturer Part Number: PMEG2010AEH,115; Package Body Material: Plastic; Number of Elements: 1; Max Power Dissipation: 830mW; Time @ Peak Reflow Temperature-Max (s): 30s; Reference Standard: IEC-60134; Supplier 1: Digi-Key; RoHS: Yes; Category: Rectifier Diodes; Pricing 1: 1=0,41000, 10=0,30500, 100=0,17290, 500=0,11452, 1000=0,08779 (USD); Number of Pins: 2; Diode Element Material: SILICON; Package Shape: Rectangular; Terminal Finish: Tin; Max Operating Temperature: 150°C; JESD-609 Code: e3; Diode Type: RECTIFIER; JESD-30 Code: R-PDSO-F2; Moisture Sensitivity Level: 1; Max Output Current: 1A; Package Style: SMALL OUTLINEMeter; Peak Reflow Temperature (Cel): 260°C; Surface Mount: Yes; Technology: SCHOTTKY; Terminal Form: Flat; Terminal Position: DUAL; REACH SVHC: Yes; RoHS Compliant: Yes; ComponentLink1URL: https://datasheet.ciiva.com:443/pdfs/VipMasterIC/IC/NEXP/NEXP-S-A0006011475/NEXP-S-A0006011475-1.pdf?src-supplier=IHS+Markit; ComponentLink1Description: https://datasheet.ciiva.com:443/pdfs/VipMasterIC/IC/NEXP/NEXP-S-A0006011475/NEXP-S-A0006011475-1.pdf?src-supplier=IHS+Markit; ComponentLink2URL: http://www.farnell.com/datasheets/109656.pdf?src-supplier=Farnell; ComponentLink2Description: http://www.farnell.com/datasheets/109656.pdf?src-supplier=Farnell; ComponentLink3URL: https://assets.nexperia.com/documents/data-sheet/PMEG2010AEH_PMEG2010AET.pdf?src-supplier=Digi-Key; ComponentLink3Description: https://assets.nexperia.com/documents/data-sheet/PMEG2010AEH_PMEG2010AET.pdf?src-supplier=Digi-Key; Supplier Part Number 1: 1727-3856-1-ND
D19 = DRTR5V0U2SR-7: Trans Voltage Suppressor Diode, 5.5V V(RWM), Unidirectional, 1 Element, Silicon; Manufacturer: Diodes; Package Body Material: Plastic; Max Breakdown Voltage: 9V; Min Breakdown Voltage: 6V; Number of Elements: 1; Max Power Dissipation: 400mW; Additional Feature: HIGH RELIABILITY; Reference Standard: AEC-Q101; Supplier 1: Digi-Key; Manufacturer Part Number: DRTR5V0U2SR-7; RoHS: Yes; Category: TVS Diodes; Stock 1: 102426; Pricing 1: 1=0,40000, 10=0,32300, 100=0,22000, 500=0,16500, 1000=0,12375 (USD); Number of Pins: 4; Diode Element Material: SILICON; Package Shape: Rectangular; Terminal Finish: Tin; Min Operating Temperature: -65°C; Max Operating Temperature: 150°C; JESD-609 Code: e3; Polarity: Unidirectional; Diode Type: TRANS VOLTAGE SUPPRESSOR; JESD-30 Code: R-PDSO-G4; Moisture Sensitivity Level: 1; Package Style: SMALL OUTLINEMeter; Rep Pk Reverse Voltage-Max: 5.5V; Surface Mount: Yes; Technology: AVALANCHE; Terminal Form: Gull Wing; Terminal Position: DUAL; REACH SVHC: Yes; RoHS Compliant: Yes; ComponentLink1URL: https://datasheet.ciiva.com:443/pdfs/VipMasterIC/IC/DIOD/DIODS20209/DIODS20209-1.pdf?src-supplier=IHS+Markit; ComponentLink1Description: https://datasheet.ciiva.com:443/pdfs/VipMasterIC/IC/DIOD/DIODS20209/DIODS20209-1.pdf?src-supplier=IHS+Markit; ComponentLink2URL: https://datasheet.ciiva.com/29588/drtr5v0u2sr-29588600.pdf?src-supplier=Digi-Key; ComponentLink2Description: https://datasheet.ciiva.com/29588/drtr5v0u2sr-29588600.pdf?src-supplier=Digi-Key; ComponentLink3URL: https://datasheet.ciiva.com/48480/drtr5v0u2sr-48480031.pdf?src-supplier=Avnet; ComponentLink3Description: https://datasheet.ciiva.com/48480/drtr5v0u2sr-48480031.pdf?src-supplier=Avnet; ComponentLink4URL: https://datasheet.ciiva.com/29588/drtr5v0u2sr-29588602.pdf?src-supplier=Digi-Key; ComponentLink4Description: https://datasheet.ciiva.com/29588/drtr5v0u2sr-29588602.pdf?src-supplier=Digi-Key; Supplier Part Number 1: DRTR5V0U2SR-7DICT-ND
F1 = Polyfuse: PTC Resettable Fuse, 60V, Surface Mount; Manufacturer: Bourns; Manufacturer Part Number: MF-MSMF014-2; Rated Power Dissipation (P): 800mW; Rated Temperature: 85°C; Thermistor Application: OVERLOAD PROTECTION; Package Height: 1.1mm; Package Length: 4.73mm; Package Width: 3.41mm; Reference Standard: AEC-Q200; Category: Fuses; RoHS: Yes; ComponentLink2Description: https://datasheet.ciiva.com/326/mfmsmf-326400.pdf?src-supplier=Avnet; ComponentLink2URL: https://datasheet.ciiva.com/326/mfmsmf-326400.pdf?src-supplier=Avnet; Supplier 1: Digi-Key; Stock 1: 40; Pricing 1: 1=0,32000, 5=0,31000, 10=0,29500, 50=0,26360, 100=0,24540, 250=0,21816, 500=0,18180 (USD); Mount: Surface Mount; Number of Pins: 2; Package Shape: Rectangular; Terminal Finish: Nickel; Min Operating Temperature: -40°C; Max Operating Temperature: 85°C; JESD-609 Code: e4; Resistor Type: PTC RESETTABLE FUSE; Package Style: SMTMeter; Packaging: Tape and Reel; Rated AC Voltage (URac): 60V; Terminal Placement: Dual Ended; Termination: Wraparound; REACH SVHC: Yes; RoHS Compliant: Yes; ComponentLink1URL: https://datasheet.ciiva.com:443/pdfs/VipMasterIC/IC/BOUR/BOUR-S-A0007011521/BOUR-S-A0007011521-1.pdf?src-supplier=IHS+Markit; ComponentLink1Description: https://datasheet.ciiva.com:443/pdfs/VipMasterIC/IC/BOUR/BOUR-S-A0007011521/BOUR-S-A0007011521-1.pdf?src-supplier=IHS+Markit; ComponentLink3URL: https://datasheet.ciiva.com/19479/1164162-19479036.pdf?src-supplier=Jameco; ComponentLink3Description: https://datasheet.ciiva.com/19479/1164162-19479036.pdf?src-supplier=Jameco; ComponentLink4URL: https://datasheet.ciiva.com/14539/70153434-14539176.pdf?src-supplier=Allied+Electronics; ComponentLink4Description: https://datasheet.ciiva.com/14539/70153434-14539176.pdf?src-supplier=Allied+Electronics; ComponentLink5URL: https://datasheet.ciiva.com/1274/1786007-1274476.pdf?src-supplier=Element14; ComponentLink5Description: https://datasheet.ciiva.com/1274/1786007-1274476.pdf?src-supplier=Element14; ComponentLink6URL: https://datasheet.ciiva.com/1274/1786007-1274492.pdf?src-supplier=Element14; ComponentLink6Description: https://datasheet.ciiva.com/1274/1786007-1274492.pdf?src-supplier=Element14; ComponentLink7URL: https://datasheet.ciiva.com/3019/mfmsmf-3019615.pdf?src-supplier=Avnet; ComponentLink7Description: https://datasheet.ciiva.com/3019/mfmsmf-3019615.pdf?src-supplier=Avnet; ComponentLink8URL: https://datasheet.ciiva.com/326/mfmsmf-326761.pdf?src-supplier=Digi-Key; ComponentLink8Description: https://datasheet.ciiva.com/326/mfmsmf-326761.pdf?src-supplier=Digi-Key; ComponentLink9URL: https://datasheet.ciiva.com/326/mfmsmf-326762.pdf?src-supplier=Digi-Key; ComponentLink9Description: https://datasheet.ciiva.com/326/mfmsmf-326762.pdf?src-supplier=Digi-Key; ComponentLink10URL: https://datasheet.ciiva.com/326/mfmsmf-326760.pdf?src-supplier=Digi-Key; ComponentLink10Description: https://datasheet.ciiva.com/326/mfmsmf-326760.pdf?src-supplier=Digi-Key; Supplier Part Number 1: MF-MSMF014-2CT-ND
H1 H2 = MountingHole_Pad: Mounting hole
J1 J3 = JST-GH-2: Connector Header, GH Series, 2 Position, 1.25mm, 50V, Surface Mount, Locking Ramp, Natural; Manufacturer: JST; Manufacturer Part Number: BM02B-GHS-TBT(LF)(SN)(N); Supplier 1: Digi-Key; RoHS: Yes; Category: Connectors; Pricing 1: 1=0,40000, 10=0,33900, 100=0,26400, 500=0,22628, 1000=0,18856 (USD); ComponentLink1URL: http://www.jst-mfg.com/product/pdf/eng/eGH.pdf?src-supplier=Digi-Key; ComponentLink1Description: http://www.jst-mfg.com/product/pdf/eng/eGH.pdf?src-supplier=Digi-Key; Supplier Part Number 1: 455-1578-6-ND
J2 = USB_micro: USB Connector, 5 Contact(s), Female, Right Angle, Surface Mount Terminal, Locking, Receptacle; Manufacturer: Molex; Manufacturer Part Number: 47589-0001; Connector Type: TELECOM AND DATACOM CONNECTOR; Number of Contacts: 5; Option: General Purpose; Additional Feature: Shielded; Empty Shell: No; Board Mounting Option: LOCATING POSTS; Durability: 10000Cycles; Number Of Connectors: 1; PCB Contact Pattern: RECTANGULAR; Polarization Key: POLARIZED HOUSING; Rated Current (Signal): 1.8A; Body Breadth: 0.118inch; Body Depth: 0.228inch; Body Length: 0.323inch; Reference Standard: UL; Reliability: COMMERCIAL; RoHS: Yes; Supplier 1: Digi-Key; Supplier Part Number 1: WM17143CT-ND; Category: USB Connectors; Stock 1: 6196; Pricing 1: 1=0,82000, 10=0,67500, 100=0,56260 (USD); Mount: Cable; Contact Finish - Mating: NOT SPECIFIED; Shell Material: Stainless Steel; Contact Finish - Termination: GOLD/NICKEL (AU/NI); Insulation Material: Polymer; Shell Finish: Tin; Min Operating Temperature: -20°C; Max Operating Temperature: 85°C; JESD-609 Code: e4; Body/Shell Style: RECEPTACLE; Contact Gender: Female; Filter Feature: No; Mixed Contacts: No; Mounting Style: RIGHT ANGLE; Termination: SMD/SMT; Number Of PCB Rows: 1; Mounting Option 1: LOCKING; REACH SVHC: Yes; RoHS Compliant: Yes; DIN Conformance: No; IEC Conformance: No; MIL Conformance: No; ComponentLink1URL: https://datasheet.ciiva.com:443/pdfs/VipMasterIC/IC/MOLE/MOLE-S-A0003718320/MOLE-S-A0003718320-1.pdf?src-supplier=IHS+Markit; ComponentLink1Description: https://datasheet.ciiva.com:443/pdfs/VipMasterIC/IC/MOLE/MOLE-S-A0003718320/MOLE-S-A0003718320-1.pdf?src-supplier=IHS+Markit; ComponentLink2URL: https://datasheet.ciiva.com/16148/0475890001-io-connectors-16148921.pdf?src-supplier=Onlinecomponents.com; ComponentLink2Description: https://datasheet.ciiva.com/16148/0475890001-io-connectors-16148921.pdf?src-supplier=Onlinecomponents.com; ComponentLink3URL: https://datasheet.ciiva.com/15181/getdatasheetpartid-158670-15181214.pdf?src-supplier=Verical; ComponentLink3Description: https://datasheet.ciiva.com/15181/getdatasheetpartid-158670-15181214.pdf?src-supplier=Verical; ComponentLink4URL: https://datasheet.ciiva.com/11731/0900766b80dfe0a8-11731295.pdf?src-supplier=RSComponents; ComponentLink4Description: https://datasheet.ciiva.com/11731/0900766b80dfe0a8-11731295.pdf?src-supplier=RSComponents; ComponentLink5URL: https://datasheet.ciiva.com/1098/1597783-1098478.pdf?src-supplier=Element14; ComponentLink5Description: https://datasheet.ciiva.com/1098/1597783-1098478.pdf?src-supplier=Element14; ComponentLink6URL: https://datasheet.ciiva.com/32371/0475890001-io-connectors-32371755.pdf?src-supplier=Onlinecomponents.com; ComponentLink6Description: https://datasheet.ciiva.com/32371/0475890001-io-connectors-32371755.pdf?src-supplier=Onlinecomponents.com
Q1-Q12 = BSC021N08NS5ATMA1: N-Channel 80V 100A (Tc) 214W (Tc) Surface Mount PG-TSON-8-3; Manufacturer: Infineon; Supplier 1: Digi-Key; Manufacturer Part Number: BSC021N08NS5ATMA1; RoHS: No; Pricing 1: 1=5,19000, 10=4,65800, 100=3,81650, 500=3,26200 (USD); Supplier Part Number 1: 448-BSC021N08NS5ATMA1CT-ND
Q13 = BSS138: Small Signal Field-Effect Transistor, 0.28A I(D), 60V, 1-Element, N-Channel, Silicon, Metal-oxide Semiconductor FET; Manufacturer: Infineon; Manufacturer Part Number: BSS138WH6433XTMA1; Package Body Material: Plastic; Drain Current-Max (ID): 280mA; Drain-source On Resistance-Max: 3.5R; Feedback Cap-Max (Crss): 4.2pF; Number of Elements: 1; Operating Mode: ENHANCEMENT MODE; Reference Standard: AEC-Q101; Supplier 1: Digi-Key; RoHS: Yes; Category: MOSFETs; Stock 1: 10000; Pricing 1: 1=0,44000, 10=0,32800, 100=0,18590, 500=0,12312, 1000=0,09439, 2000=0,08208, 5000=0,07387 (USD); Number of Pins: 3; Package Shape: Rectangular; Transistor Element Material: SILICON; Polarity/Channel Type: N-CHANNEL; DS Breakdown Voltage-Min: 60V; FET Technology: METAL-OXIDE SEMICONDUCTOR; JESD-30 Code: R-PDSO-G3; Package Style: SMALL OUTLINEMeter; Surface Mount: Yes; Terminal Form: Gull Wing; Terminal Position: DUAL; REACH SVHC: Yes; RoHS Compliant: Yes; ComponentLink1URL: https://datasheet.ciiva.com:443/pdfs/VipMasterIC/IC/INFN/INFNS17556/INFNS17556-1.pdf?src-supplier=IHS+Markit; ComponentLink1Description: https://datasheet.ciiva.com:443/pdfs/VipMasterIC/IC/INFN/INFNS17556/INFNS17556-1.pdf?src-supplier=IHS+Markit; ComponentLink2URL: https://datasheet.ciiva.com/11174/infineon-bss138w-ds-v02-43-en-11174480.pdf?src-supplier=Avnet; ComponentLink2Description: https://datasheet.ciiva.com/11174/infineon-bss138w-ds-v02-43-en-11174480.pdf?src-supplier=Avnet; Supplier Part Number 1: BSS138WH6433XTMA1CT-ND
R1-R3 R7-R12 R16-R18 = RES_0603: Res SMD 4.3 Ohm 5% 1/4W 0603; Manufacturer: Panasonic; Manufacturer Part Number: ERJ-PA3J4R3V; Supplier 1: Digi-Key; Supplier Part Number 1: P4.3BZCT-ND; RoHS: Yes; Category: Chip SMD Resistors; Stock 1: 16566; Pricing 1: 1=0,13000, 10=0,11700, 100=0,04500, 1000=0,01980, 2500=0,01710 (USD); ComponentLink1URL: https://industrial.panasonic.com/cdbs/www-data/pdf/RDO0000/AOA0000C331.pdf?src-supplier=Digi-Key; ComponentLink1Description: https://industrial.panasonic.com/cdbs/www-data/pdf/RDO0000/AOA0000C331.pdf?src-supplier=Digi-Key; ComponentLink2URL: https://industrial.panasonic.com/ww/system/files/data/download/catalog/id_fixed-resistors_e_1.pdf?src-supplier=Digi-Key; ComponentLink2Description: https://industrial.panasonic.com/ww/system/files/data/download/catalog/id_fixed-resistors_e_1.pdf?src-supplier=Digi-Key
R4-R6 R13-R15 = RES_0603: Chip Resistor; Manufacturer: Panasonic; Manufacturer Part Number: ERJ-UP3J104V; Supplier 1: Digi-Key; Supplier Part Number 1: 10-ERJ-UP3J104VCT-ND; RoHS: No; Category: Chip SMD Resistors; Stock 1: 35908; Pricing 1: 1=0,18000, 10=0,15100, 100=0,05910, 1000=0,02475, 2500=0,02269 (USD); Value: 100k
R19 R20 = Shunt_res: Fixed Resistor, Metal Strip, 3W, 0.002ohm, 0.077V, 1% +/-Tol, 275ppm/Cel, Surface Mount, 2512; Manufacturer: Vishay Dale; Manufacturer Part Number: WSLP25122L000FEA; Rated Temperature: 70°C; Resistance: 2mR; Temperature Coefficient: 275ppm/°C; Package Height: 0.635mm; Package Length: 6.35mm; Package Width: 3.18mm; Reference Standard: AEC-Q200; Supplier 1: Digi-Key; RoHS: Yes; Category: Chip SMD Resistors; Stock 1: 1860; Pricing 1: 1=1,82000, 10=1,61300, 25=1,49560, 50=1,40760, 100=1,23160, 250=1,05568, 500=0,87976, 1000=0,79764 (USD); Mount: Surface Mount; Number of Pins: 2; Package Shape: Rectangular; Size Code: 2512; Terminal Finish: Nickel; Min Operating Temperature: -65°C; Max Operating Temperature: 170°C; Tolerance: 1%; JESD-609 Code: e3; Resistor Type: FIXED RESISTOR; Construction: Chip; Package Style: SMTMeter; Packaging: Tape and Reel; Rated Power Dissipation (P): 3W; Technology: METAL STRIP; Termination: Wraparound; REACH SVHC: Yes; RoHS Compliant: Yes; ComponentLink1URL: https://datasheet.ciiva.com:443/pdfs/VipMasterIC/IC/VISH/VISH-S-A0009590861/VISH-S-A0009590861-1.pdf?src-supplier=IHS+Markit; ComponentLink1Description: https://datasheet.ciiva.com:443/pdfs/VipMasterIC/IC/VISH/VISH-S-A0009590861/VISH-S-A0009590861-1.pdf?src-supplier=IHS+Markit; ComponentLink2URL: https://datasheet.ciiva.com/48527/wslp-48527354.pdf?src-supplier=Avnet; ComponentLink2Description: https://datasheet.ciiva.com/48527/wslp-48527354.pdf?src-supplier=Avnet; Supplier Part Number 1: 541-10148-1-ND
R22 R23 R32 R33 = RES_0603: Res Thick Film 0603 4.3 Ohm 1% 0.1W(1/10W) -100ppm/C to 600ppm/C Sulfur Resistant Pad SMD Automotive T/R; Manufacturer: Panasonic; Manufacturer Part Number: ERJ-U03F4R30V; Supplier 1: Digi-Key; Supplier Part Number 1: 10-ERJ-U03F4R30VCT-ND; RoHS: No; Stock 1: 14777; Pricing 1: 1=0,16000, 10=0,14300, 100=0,05500, 1000=0,02420, 2500=0,02090 (USD)
R24 R25 R30 R31 = RES_0603: Fixed Resistor, Metal Glaze/thick Film, 0.1W, 1000ohm, 75V, 1% +/-Tol, 100ppm/Cel, Surface Mount, 0603; Manufacturer: Panasonic; Manufacturer Part Number: ERJ3EKF1001V; Rated Power Dissipation (P): 100mW; Rated Temperature: 70°C; Resistance: 1kR; Temperature Coefficient: 100ppm/°C; Package Height: 0.45mm; Package Length: 1.6mm; Package Width: 0.8mm; Reference Standard: AEC-Q200; Supplier 1: Digi-Key; Supplier Part Number 1: P1.00KHCT-ND; RoHS: Yes; Category: Chip SMD Resistors; Stock 1: 2284; Pricing 1: 1=0,10000, 10=0,05300, 100=0,02140, 1000=0,00961, 2500=0,00834 (USD); Mount: Surface Mount; Number of Pins: 2; Size Code: 0603; Terminal Finish: Nickel; Package Shape: Rectangular; Min Operating Temperature: -55°C; Max Operating Temperature: 155°C; Tolerance: 1%; JESD-609 Code: e3; Resistor Type: FIXED RESISTOR; Construction: Rectangular; Package Style: SMTMeter; Packaging: Tape and Reel; Technology: METAL GLAZE/THICK FILM; Termination: Wraparound; Working Voltage: 75V; REACH SVHC: Yes; RoHS Compliant: Yes; ComponentLink1URL: https://datasheet.ciiva.com:443/pdfs/VipMasterIC/IC/PANA/PANA-S-A0009889626/PANA-S-A0009889626-1.pdf?src-supplier=IHS+Markit; ComponentLink1Description: https://datasheet.ciiva.com:443/pdfs/VipMasterIC/IC/PANA/PANA-S-A0009889626/PANA-S-A0009889626-1.pdf?src-supplier=IHS+Markit; ComponentLink2URL: https://datasheet.ciiva.com/7942/aoa0000ce2-7942427.pdf?src-supplier=Element14; ComponentLink2Description: https://datasheet.ciiva.com/7942/aoa0000ce2-7942427.pdf?src-supplier=Element14; ComponentLink3URL: https://datasheet.ciiva.com/46373/1678782-46373340.pdf?src-supplier=Element14; ComponentLink3Description: https://datasheet.ciiva.com/46373/1678782-46373340.pdf?src-supplier=Element14; ComponentLink4URL: https://datasheet.ciiva.com/22673/1678782-22673918.pdf?src-supplier=Element14; ComponentLink4Description: https://datasheet.ciiva.com/22673/1678782-22673918.pdf?src-supplier=Element14; ComponentLink5URL: https://datasheet.ciiva.com/46373/1678782-46373339.pdf?src-supplier=Element14; ComponentLink5Description: https://datasheet.ciiva.com/46373/1678782-46373339.pdf?src-supplier=Element14; ComponentLink6URL: https://datasheet.ciiva.com/24070/aoa0000ce2-24070269.pdf?src-supplier=Mouser; ComponentLink6Description: https://datasheet.ciiva.com/24070/aoa0000ce2-24070269.pdf?src-supplier=Mouser; ComponentLink7URL: https://datasheet.ciiva.com/16768/70260748-16768437.pdf?src-supplier=Allied+Electronics; ComponentLink7Description: https://datasheet.ciiva.com/16768/70260748-16768437.pdf?src-supplier=Allied+Electronics; ComponentLink8URL: https://datasheet.ciiva.com/16774/70260748-16774550.pdf?src-supplier=Allied+Electronics; ComponentLink8Description: https://datasheet.ciiva.com/16774/70260748-16774550.pdf?src-supplier=Allied+Electronics; ComponentLink9URL: https://datasheet.ciiva.com/9198/aoa0000ce2-9198923.pdf?src-supplier=Avnet; ComponentLink9Description: https://datasheet.ciiva.com/9198/aoa0000ce2-9198923.pdf?src-supplier=Avnet; ComponentLink10URL: https://datasheet.ciiva.com/16449/aoa0000ce2-16449065.pdf?src-supplier=Future+Electronics; ComponentLink10Description: https://datasheet.ciiva.com/16449/aoa0000ce2-16449065.pdf?src-supplier=Future+Electronics; ComponentLink11URL: https://datasheet.ciiva.com/48530/aoa0000ce2-48530987.pdf?src-supplier=Avnet; ComponentLink11Description: https://datasheet.ciiva.com/48530/aoa0000ce2-48530987.pdf?src-supplier=Avnet; ComponentLink12URL: https://datasheet.ciiva.com/30063/aoa0000ce2-30063390.pdf?src-supplier=Onlinecomponents.com; ComponentLink12Description: https://datasheet.ciiva.com/30063/aoa0000ce2-30063390.pdf?src-supplier=Onlinecomponents.com